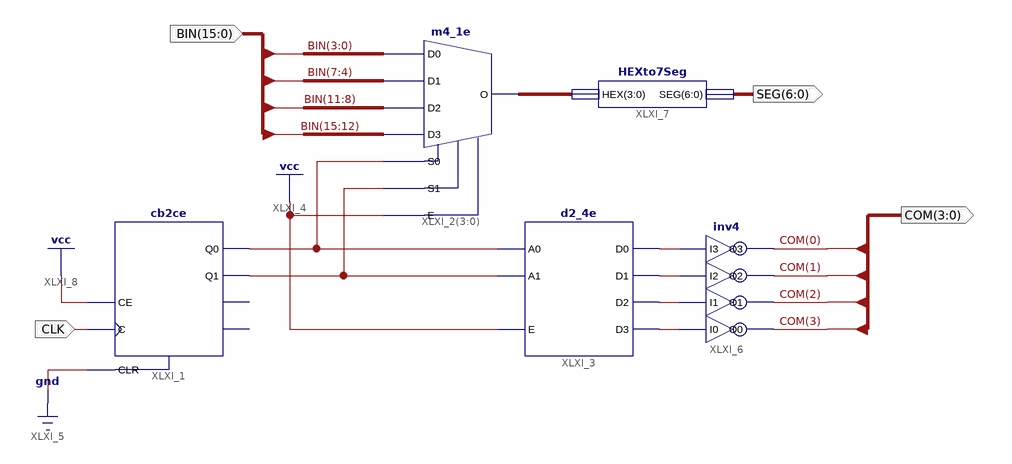
[diagram p0: schematic sheet 1]
// Xilinx ISE schematic HEXto7Seg4Digit.sch (spartan6) as structural Verilog: 5 symbols, 4 ports
module HEXto7Seg4Digit (
  input  [15:0] BIN,
  input  CLK,
  output [6:0] SEG,
  output [3:0] COM
);

  wire XLXN_7, XLXN_8, XLXN_24, XLXN_25, XLXN_26, XLXN_27;
  wire [3:0] XLXN_28;

  cb2ce XLXI_1 (.C(CLK), .CE(1'b1), .CLR(1'b0), .Q0(XLXN_7), .Q1(XLXN_8));  // open: CEO, TC
  m4_1e XLXI_2[3:0] (
    .D0(BIN[3:0]), .D1(BIN[7:4]), .D2(BIN[11:8]), .D3(BIN[15:12]), .E(1'b1), .S0(XLXN_7), .S1(XLXN_8),
    .O(XLXN_28));
  d2_4e XLXI_3 (.A0(XLXN_7), .A1(XLXN_8), .E(1'b1), .D0(XLXN_24), .D1(XLXN_25), .D2(XLXN_26), .D3(XLXN_27));
  inv4 XLXI_6 (
    .I0(XLXN_27), .I1(XLXN_26), .I2(XLXN_25), .I3(XLXN_24), .O0(COM[3]), .O1(COM[2]), .O2(COM[1]), .O3(COM[0]));
  HEXto7Seg XLXI_7 (.HEX(XLXN_28), .SEG(SEG));
endmodule
